# EAGLE design mssaPIC16 (EAGLE 9.6.2)
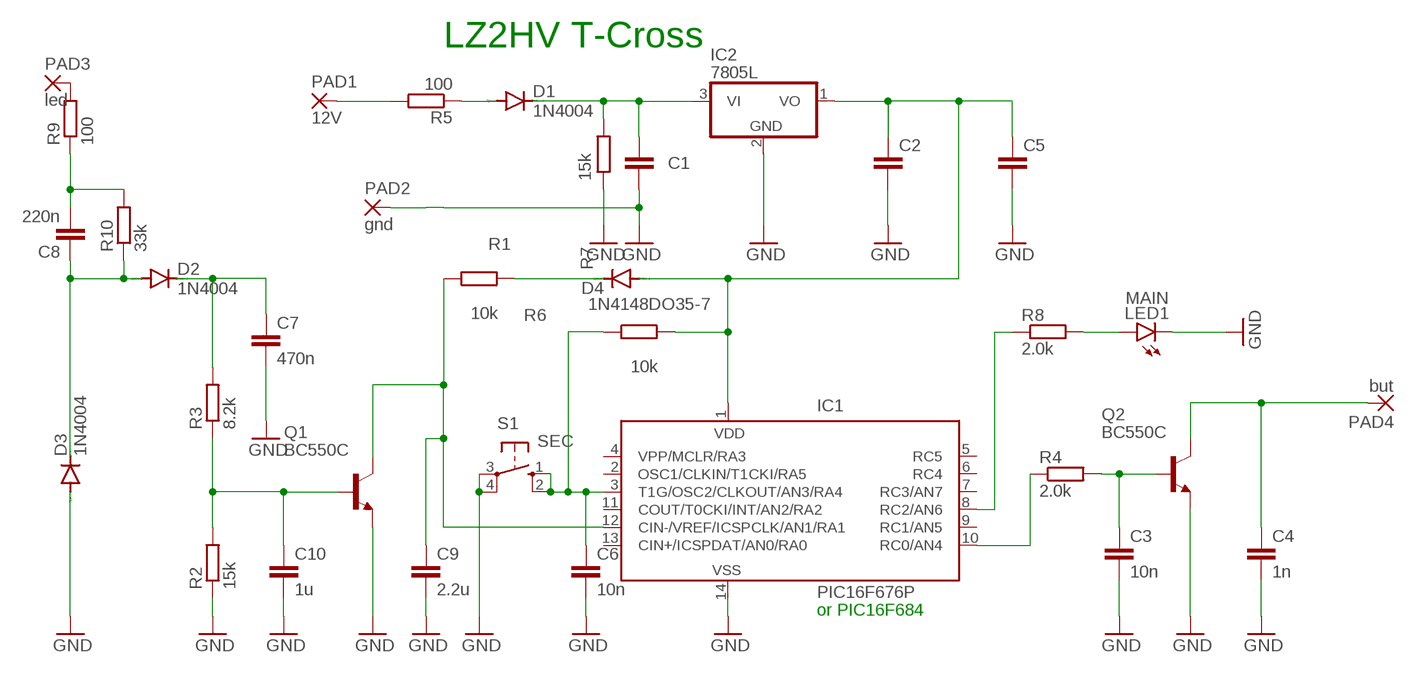
[diagram p0: schematic, sheet 1]

## Parts
C1  100n  C5/2.5  [C5B2.5]
C2  101n  C5/2.5  [C5B2.5]
C3  10n  C5/2.5  [C5B2.5]
C4  1n  C5/2.5  [C5B2.5]
C5  220n  C5/2.5  [C5B2.5]
C6  10n  C5/2.5  [C5B2.5]
C7  470n  C5/2.5  [C5B2.5]
C8  220n  C5/2.5  [C5B2.5]
C9  2.2u  C5/2.5  [C5B2.5]
C10  1u  C5/2.5  [C5B2.5]
D1  1N4004  [DO41-10]
D2  1N4004  [DO41-10]
D3  1N4004  [DO41-10]
D4  1N4148DO35-7  [DO35-7]
IC1  PIC16F676P  [DIL14]
IC2  7805L  [TO92]
LED1  MAIN  LED3MM  [LED3MM]
PAD1  12V  2,54/1,0  [2,54/1,0]
PAD2  gnd  2,54/1,0  [2,54/1,0]
PAD3  led  2,54/1,0  [2,54/1,0]
PAD4  but  2,54/1,0  [2,54/1,0]
Q1  BC550C  [TO92-EBC]
Q2  BC550C  [TO92-EBC]
R1  10k  R-EU_0207/7  [0207/7]
R2  15k  R-EU_0207/7  [0207/7]
R3  8.2k  R-EU_0207/7  [0207/7]
R4  2.0k  R-EU_0207/7  [0207/7]
R5  100  R-EU_0207/7  [0207/7]
R6  10k  R-EU_0207/7  [0207/7]
R7  15k  R-EU_0207/7  [0207/7]
R8  2.0k  R-EU_0207/7  [0207/7]
R9  100  R-EU_0207/2V  [0207/2V]
R10  33k  R-EU_0207/2V  [0207/2V]
S1  SEC  10-XX  [B3F-10XX]

## Nets
GND: C1.2 C2.2 C3.2 C4.2 C5.2 C6.2 C7.2 C9.2 C10.2 D3.A IC1.14(VSS) IC2.2(GND) LED1.K(C) PAD2.1(P) Q1.E Q2.E R2.1 R7.1 S1.3(P) S1.4(P1)
N$1: C1.1 D1.C IC2.3(VI) R7.2
N$2: C2.1 C5.1 D4.A IC1.1(VDD) IC2.1(VO) R6.2
N$3: C10.1 Q1.B R2.2 R3.1
N$4: C9.1 IC1.12(CIN-/VREF/ICSPCLK/AN1/RA1) Q1.C R1.1
N$5: PAD1.1(P) R5.2
N$6: IC1.10(RC0/AN4) R4.1
N$7: C3.1 Q2.B R4.2
N$8: C4.1 PAD4.1(P) Q2.C
N$9: C7.1 D2.C R3.2
N$10: D1.A R5.1
N$11: C6.1 IC1.3(T1G/OSC2/CLKOUT/AN3/RA4) R6.1 S1.1(S) S1.2(S1)
N$12: C8.2 R9.1 R10.2
N$13: C8.1 D2.A D3.C R10.1
N$14: LED1.A R8.2
N$15: IC1.8(RC2/AN6) R8.1
N$16: D4.C R1.2
N$17: PAD3.1(P) R9.2
Unconnected: IC1.2(OSC1/CLKIN/T1CKI/RA5) IC1.4(VPP/MCLR/RA3) IC1.5(RC5) IC1.6(RC4) IC1.7(RC3/AN7) IC1.9(RC1/AN5) IC1.11(COUT/T0CKI/INT/AN2/RA2) IC1.13(CIN+/ICSPDAT/AN0/RA0)

## Notes on the sheet
- LZ2HV T-Cross
- or PIC16F684

## Library data of the parts
C1-C10 = capacitor-wima:C: CAPACITOR naming: grid - package width
D1-D3 = diode:1N4004: DIODE general purpose rectifier, 1 A
D4 = diode:1N4148: DIODE high speed (Philips)
IC1 = microchip:PIC16F676: 14-Pin, Flash-Based 8-Bit CMOS Microcontroller High Performance RISC CPU: * Only 35 instructions to learn - All single-cycle instructions except branches * Operating speed: - DC - 20 MHz oscillator/clock input - DC - 200 ns instruction cycle * Internal and external oscillator options - Precision Internal 4 MHz oscillator factory calibrated to ±1% - External Oscillator support for crystals and resonators - 5?s wake-up from SLEEP, 3.0V, typical * Power saving SLEEP mode * Wide operating voltage range - 2.0V to 5.5V * Industrial and Extended temperature range * Low power Power-on Reset (POR) * Power-up Timer (PWRT) and Oscillator Start-up Timer (OST) * Brown-out Detect (BOD) * Watchdog Timer (WDT) with independent oscillator for reliable operation * Multiplexed MCLR/Input-pin * Interrupt-on-pin change * Individual programmable weak pull-ups * Programmable code protection * High Endurance FLASH/EEPROM Cell - 100,000 write FLASH endurance - 1,000,000 write EEPROM endurance - FLASH/Data EEPROM Retention: > 40 years * Standby Current: - 1 nA @ 2.0V, typical * Operating Current: - 8.5?A @ 32 kHz, 2.0V, typical - 100?A @ 1 MHz, 2.0V, typical * Watchdog Timer Current - 300 nA @ 2.0V, typical * Timer1 oscillator current: - 4?A @ 32 kHz, 2.0V, typical * 12 I/O pins with individual direction control * High current sink/source for direct LED drive * Analog-to-Digital Converter module (PIC16F676): - 10-bit resolution - Programmable 8-channel input - Voltage reference input * In-Circuit Serial ProgrammingTM (ICSPTM) via two pins Source: http://ww1.microchip.com/downloads/en/DeviceDoc/40039E.pdf; MF: MICROCHIP; MPN: PIC16F676-I/P; OC_FARNELL: 9760512; OC_NEWARK: 54K2829
IC2 = linear:78*: Positive VOLTAGE REGULATOR Source: http://cache.national.com/ds/LM/LM78L05.pdf http://www.fairchildsemi.com/ds/LM/LM7805.pdf
LED1 = led:LED: LED OSRAM: - CHIPLED LG R971, LG N971, LY N971, LG Q971, LY Q971, LO R971, LY R971 LH N974, LH R974 LS Q976, LO Q976, LY Q976 LO Q996 - Hyper CHIPLED LW Q18S LB Q993, LB Q99A, LB R99A - SideLED LS A670, LO A670, LY A670, LG A670, LP A670 LB A673, LV A673, LT A673, LW A673 LH A674 LY A675 LS A676, LA A676, LO A676, LY A676, LW A676 LS A679, LY A679, LG A679 - Hyper Micro SIDELED® LS Y876, LA Y876, LO Y876, LY Y876 LT Y87S - SmartLED LW L88C, LW L88S LB L89C, LB L89S, LG L890 LS L89K, LO L89K, LY L89K LS L896, LA L896, LO L896, LY L896 - TOPLED LS T670, LO T670, LY T670, LG T670, LP T670 LSG T670, LSP T670, LSY T670, LOP T670, LYG T670 LG T671, LOG T671, LSG T671 LB T673, LV T673, LT T673, LW T673 LH T674 LS T676, LA T676, LO T676, LY T676, LB T676, LH T676, LSB T676, LW T676 LB T67C, LV T67C, LT T67C, LS T67K, LO T67K, LY T67K, LW E67C LS E67B, LA E67B, LO E67B, LY E67B, LB E67C, LV E67C, LT E67C LW T67C LS T679, LY T679, LG T679 LS T770, LO T770, LY T770, LG T770, LP T770 LB T773, LV T773, LT T773, LW T773 LH T774 LS E675, LA E675, LY E675, LS T675 LS T776, LA T776, LO T776, LY T776, LB T776 LHGB T686 LT T68C, LB T68C - Hyper Mini TOPLED® LB M676 - Mini TOPLED Santana® LG M470 LS M47K, LO M47K, LY M47K Source: http://www.osram.convergy.de LUXEON: - LUMILED® LXK2-PW12-R00, LXK2-PW12-S00, LXK2-PW14-U00, LXK2-PW14-V00 LXK2-PM12-R00, LXK2-PM12-S00, LXK2-PM14-U00 LXK2-PE12-Q00, LXK2-PE12-R00, LXK2-PE12-S00, LXK2-PE14-T00, LXK2-PE14-U00 LXK2-PB12-K00, LXK2-PB12-L00, LXK2-PB12-M00, LXK2-PB14-N00, LXK2-PB14-P00, LXK2-PB14-Q00 LXK2-PR12-L00, LXK2-PR12-M00, LXK2-PR14-Q00, LXK2-PR14-R00 LXK2-PD12-Q00, LXK2-PD12-R00, LXK2-PD12-S00 LXK2-PH12-R00, LXK2-PH12-S00 LXK2-PL12-P00, LXK2-PL12-Q00, LXK2-PL12-R00 Source: www.luxeon.com KINGBRIGHT: KA-3528ASYC Source: www.kingbright.com
PAD1-PAD4 = wirepad:2,54/1,0: THROUGH-HOLE PAD
Q1 Q2 = transistor-npn:BC550*: NPN Transistor
R1-R10 = rcl:R-EU_: RESISTOR, European symbol; SPICEPREFIX: R
S1 = switch-omron:10-XX: OMRON SWITCH; MPN: B3F-1000; OC_FARNELL: 176432; OC_NEWARK: 36M3542

## Board
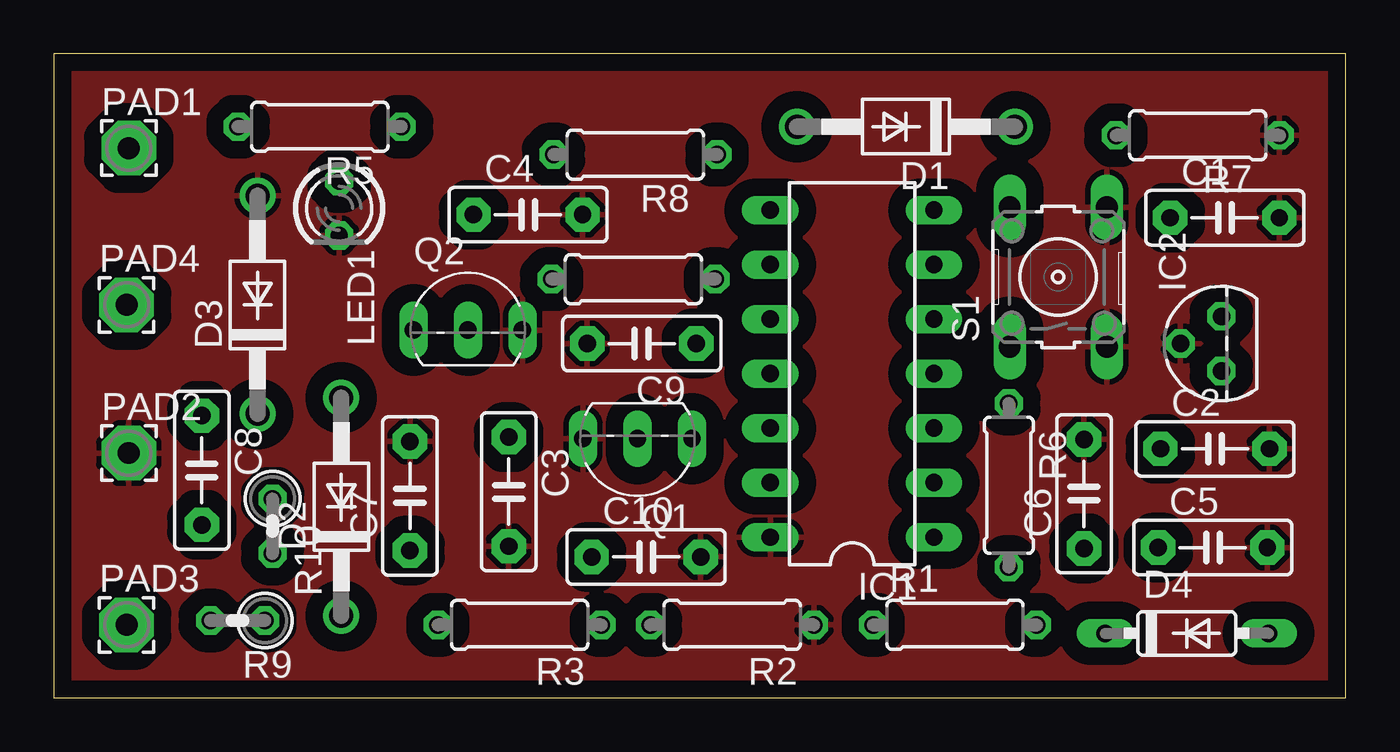
[diagram p1: board, top side]
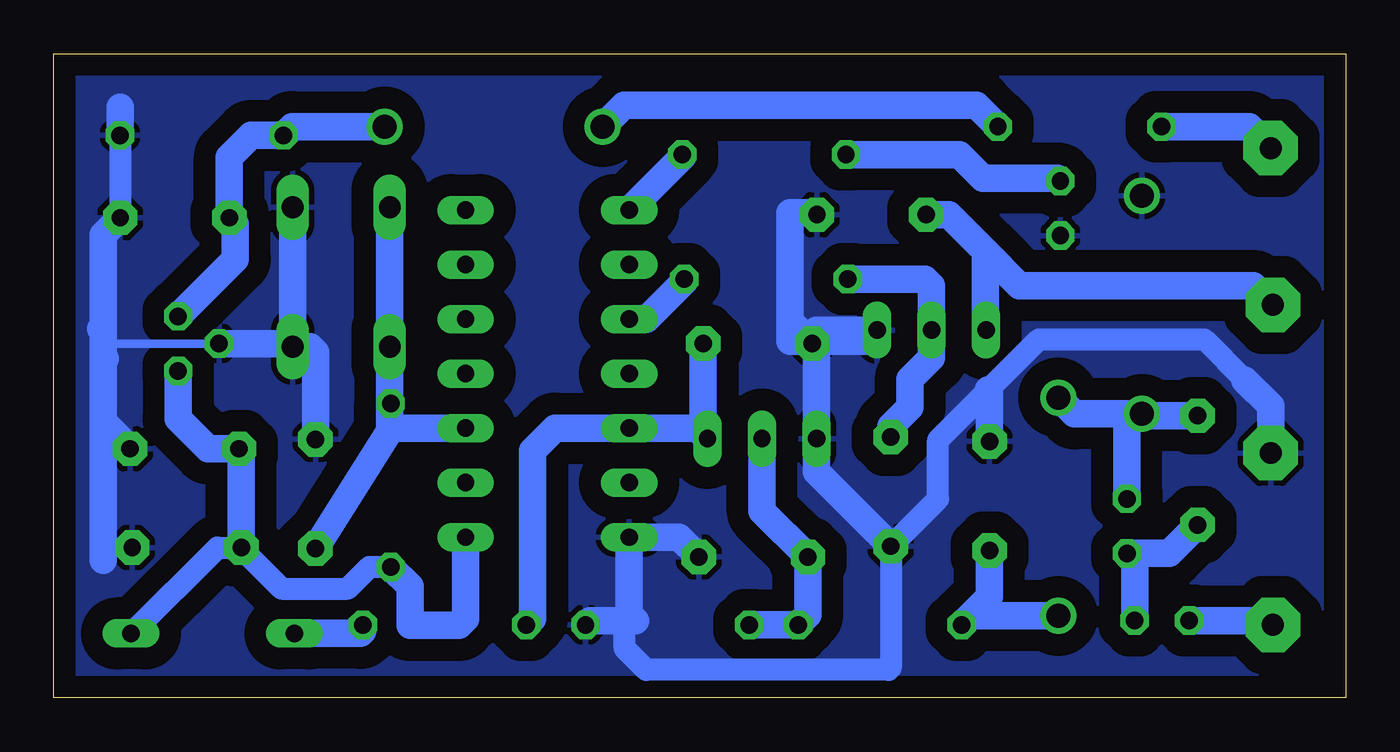
[diagram p2: board, bottom side, seen from below]

Size 60.2 x 30 mm. Coordinates in mm from the lower left corner, seen from the top.
Outline: 0,0 60.2,0 60.2,30 0,30 0,0
Copper layers (1*16): Top 0.035mm / dielectric 1.5mm / Bottom 0.035mm
Design rules "default *": minimum track width 10mil, minimum drill 24mil, track to track 8mil, track to pad 8mil, pad to pad 8mil, via to via 8mil, smd to smd 8mil, copper to edge 10mil, drill to drill 6mil, minimum pad ring 10mil, minimum via ring 8mil, stop-mask expansion 4mil, vias tented up to drill 0mil, thermal gap 10mil

### Footprints (pad centres in the part's own frame; a part is rotated, then mirrored left to right if it is on the bottom)
C5B2.5 = drill 0.813 pad 1.6 octagon: 1 -2.54,0; 2 2.54,0
DO41-10 = drill 1.118: A 5.08,0; C -5.08,0
DO35-7 = drill 0.813 long: A 3.81,0; C -3.81,0
DIL14 = drill 0.813 long: 1 -7.62,-3.81; 2 -5.08,-3.81; 3 -2.54,-3.81; 4 0,-3.81; 5 2.54,-3.81; 6 5.08,-3.81; 7 7.62,-3.81; 8 7.62,3.81; 9 5.08,3.81; 10 2.54,3.81; 11 0,3.81; 12 -2.54,3.81; 13 -5.08,3.81; 14 -7.62,3.81
TO92 = drill 0.813 octagon: 1 -1.27,0; 2 0,1.905; 3 1.27,0
LED3MM = drill 0.813 octagon: A -1.27,0; K 1.27,0
2,54/1,0 = drill 1.016 pad 2.54 octagon: 1 0,0
TO92-EBC = drill 0.813 long: B 0,-1.27; C -2.54,-1.27; E 2.54,-1.27
0207/7 = drill 0.813 octagon: 1 -3.81,0; 2 3.81,0
0207/2V = drill 0.813 octagon: 1 -1.27,0; 2 1.27,0
B3F-10XX = drill 1.016 long: 1 -3.251,2.261; 2 3.251,2.261; 3 -3.251,-2.261; 4 3.251,-2.261

### Placement (x,y rotation side)
C1  54.56,22.36 0 top
C2  54.1,11.6 0 top
C3  21.2,9.6 270 top
C4  22.1,22.5 0 top
C5  54,7 0 top
C6  48,9.5 90 top
C7  16.6,9.4 90 top
C8  6.9,10.6 270 top
C9  27.4,16.5 180 top
C10  27.6,6.56 0 top
D1  39.7,26.6 180 top
D2  13.4,8.9 90 top
D3  9.5,18.3 90 top
D4  52.79,3 0 top
IC1  37.2,15.1 90 top
IC2  54.4,16.5 90 top
LED1  13.3,22.8 270 top
PAD1  3.5,25.6 0 top
PAD2  3.5,11.4 0 top
PAD3  3.4,3.4 0 top
PAD4  3.4,18.3 0 top
Q1  27.2,10.8 180 top
Q2  19.3,18.4 0 top
R1  41.99,3.4 0 top
R2  31.61,3.4 180 top
R3  21.71,3.4 180 top
R4  27.01,19.5 180 top
R5  12.4,26.6 180 top
R6  44.5,9.9 270 top
R7  53.3,26.2 180 top
R8  27.1,25.3 180 top
R9  8.57,3.6 180 top
R10  10.2,8 270 top
S1  46.8,19.6 90 top

### Tracks (layer width: path | path; a pad name or v marks a point on that pad's centre or on a via)
GND
  Bottom 0.406: IC2.2 57.9,16.5
  Bottom 1.016: C4.2 25.44,22.5 25.5,22.56 | 57.1,27.5 C1.2 | 33.6,3.6 33.6,2.3 32.6,1.3 21.3,1.3 21.2,1.4 C3.2 19,9.26 19,12 16.65,14.35 14.3,16.7 6.6,16.7 4.7,14.8
  Bottom 1.27: C10.2 31.06,7.48 IC1.14 33.39,3.89 33.1,3.6 33.6,3.6 35.22,3.6 R2.1 | 57.9,17.3 58,17.2 | 4.7,14.8 3.5,13.6 PAD2.1 | C3.2 24.66,10.52 Q1.E 24.66,17.13 Q2.E 22.37,16.6 25.9,16.6 25.9,17.54 | 25.9,17.54 25.9,22.6 24.74,22.6 C4.2 | 57.9,17.3 57.9,16.5 57.9,15.9 | 57.9,15.9 57.9,12.86 | 57.9,12.86 C2.2 | 57.9,6.4 57.9,7 | 57.9,7 57.9,12.86 | 57.8,15.79 57.9,15.9 | 57.8,6.9 57.9,7 | C6.2 48,16.1 48.25,16.35 S1.3 | S1.3 49.21,16.5 IC2.2 | S1.3 S1.4 | R7.1 57.1,27.5 | C1.2 57.9,21.56 57.9,17.3 | C7.2 16.6,14.3 16.65,14.35 | C9.2 25.9,17.54
  pour Bottom (isolate 1.016): 0,30 60.1,30 60.1,0 0.1,0 0,-0.1
  pour Top (isolate 0.813): 0.2,29.9 60.1,29.9 60.2,30 60.2,0 60.3,-0.1 0.1,-0.1 0,-0.2 0,29.9
N$1
  Bottom 1.27: IC2.3 51.74,20.43 51.74,22.08 C1.1 52.02,25.18 51,26.2 R7.2 49.09,26.6 D1.C
N$2
  Bottom 1.016: R6.2 45.5,6.09 46.5,5.09 49.59,5.09 51.46,6.96 | D4.A 56.56,3 52.56,7 C5.1
  Bottom 1.27: IC1.1 41.01,3.68 41.31,3.38 43.6,3.38 43.6,5.19 R6.2 | IC2.1 54.4,13 53,11.6 C2.1 51.46,11.5 C5.1 51.46,6.96
N$3
  Bottom 1.27: Q1.B 27.2,8.7 C10.1 25.06,3.86 R3.1 R2.2
N$4
  Bottom 1.27: R1.1 37.9,3.68 37.9,11.5 36.84,12.56 IC1.12 30.23,12.56 Q1.C 29.94,12.27 C9.1
N$5
  Bottom 1.27: PAD1.1 4.5,26.6 R5.2
N$6
  Bottom 1.27: IC1.10 32.59,17.64 30.82,19.41 R4.1
N$7
  Bottom 1.27: R4.2 19.6,19.5 19.3,19.2 Q2.B 19.3,15.83 20.3,14.83 20.3,13.54 21.2,12.64 C3.1
N$8
  Bottom 1.27: C4.1 18.5,22.5 16.8,20.8 | 16.8,20.8 15.2,19.2 4.3,19.2 PAD4.1 | 16.8,20.8 16.8,17.17 Q2.C
N$9
  Bottom 1.27: D2.C 17.48,3.82 R3.2 16.6,4.7 C7.1
N$10
  Bottom 1.27: R5.1 17.21,27.6 33.62,27.6 D1.A
N$11
  Bottom 1.27: S1.2 S1.1 44.54,13.75 | 44.54,13.75 R6.1 | IC1.3 44.34,12.56 | 44.34,12.56 44.4,12.5 44.54,12.64 44.54,13.75 | C6.1 44.42,12.64 44.34,12.56
N$12
  Bottom 1.27: C8.2 8.23,6.73 R10.2 9.84,6.37 R9.1
N$13
  Bottom 1.27: 10.3,13.22 D3.C 9.4,13.12 9.38,13.14 C8.1 | 10.3,13.22 12.64,13.22 D2.A | R10.1 10.2,13.12 10.3,13.22
N$14
  Bottom 1.27: LED1.A 13.43,24.2 16.9,24.2 18,25.3 R8.2
N$15
  Bottom 1.27: IC1.8 30.91,25.2 R8.1
N$16
  Bottom 1.27: R1.2 45.8,3.1 45.9,3 D4.C
N$17
  Bottom 1.27: R9.2 3.6,3.6 PAD3.1